# Altium project Breathalyzer.PrjPCB (part 1 of 2)
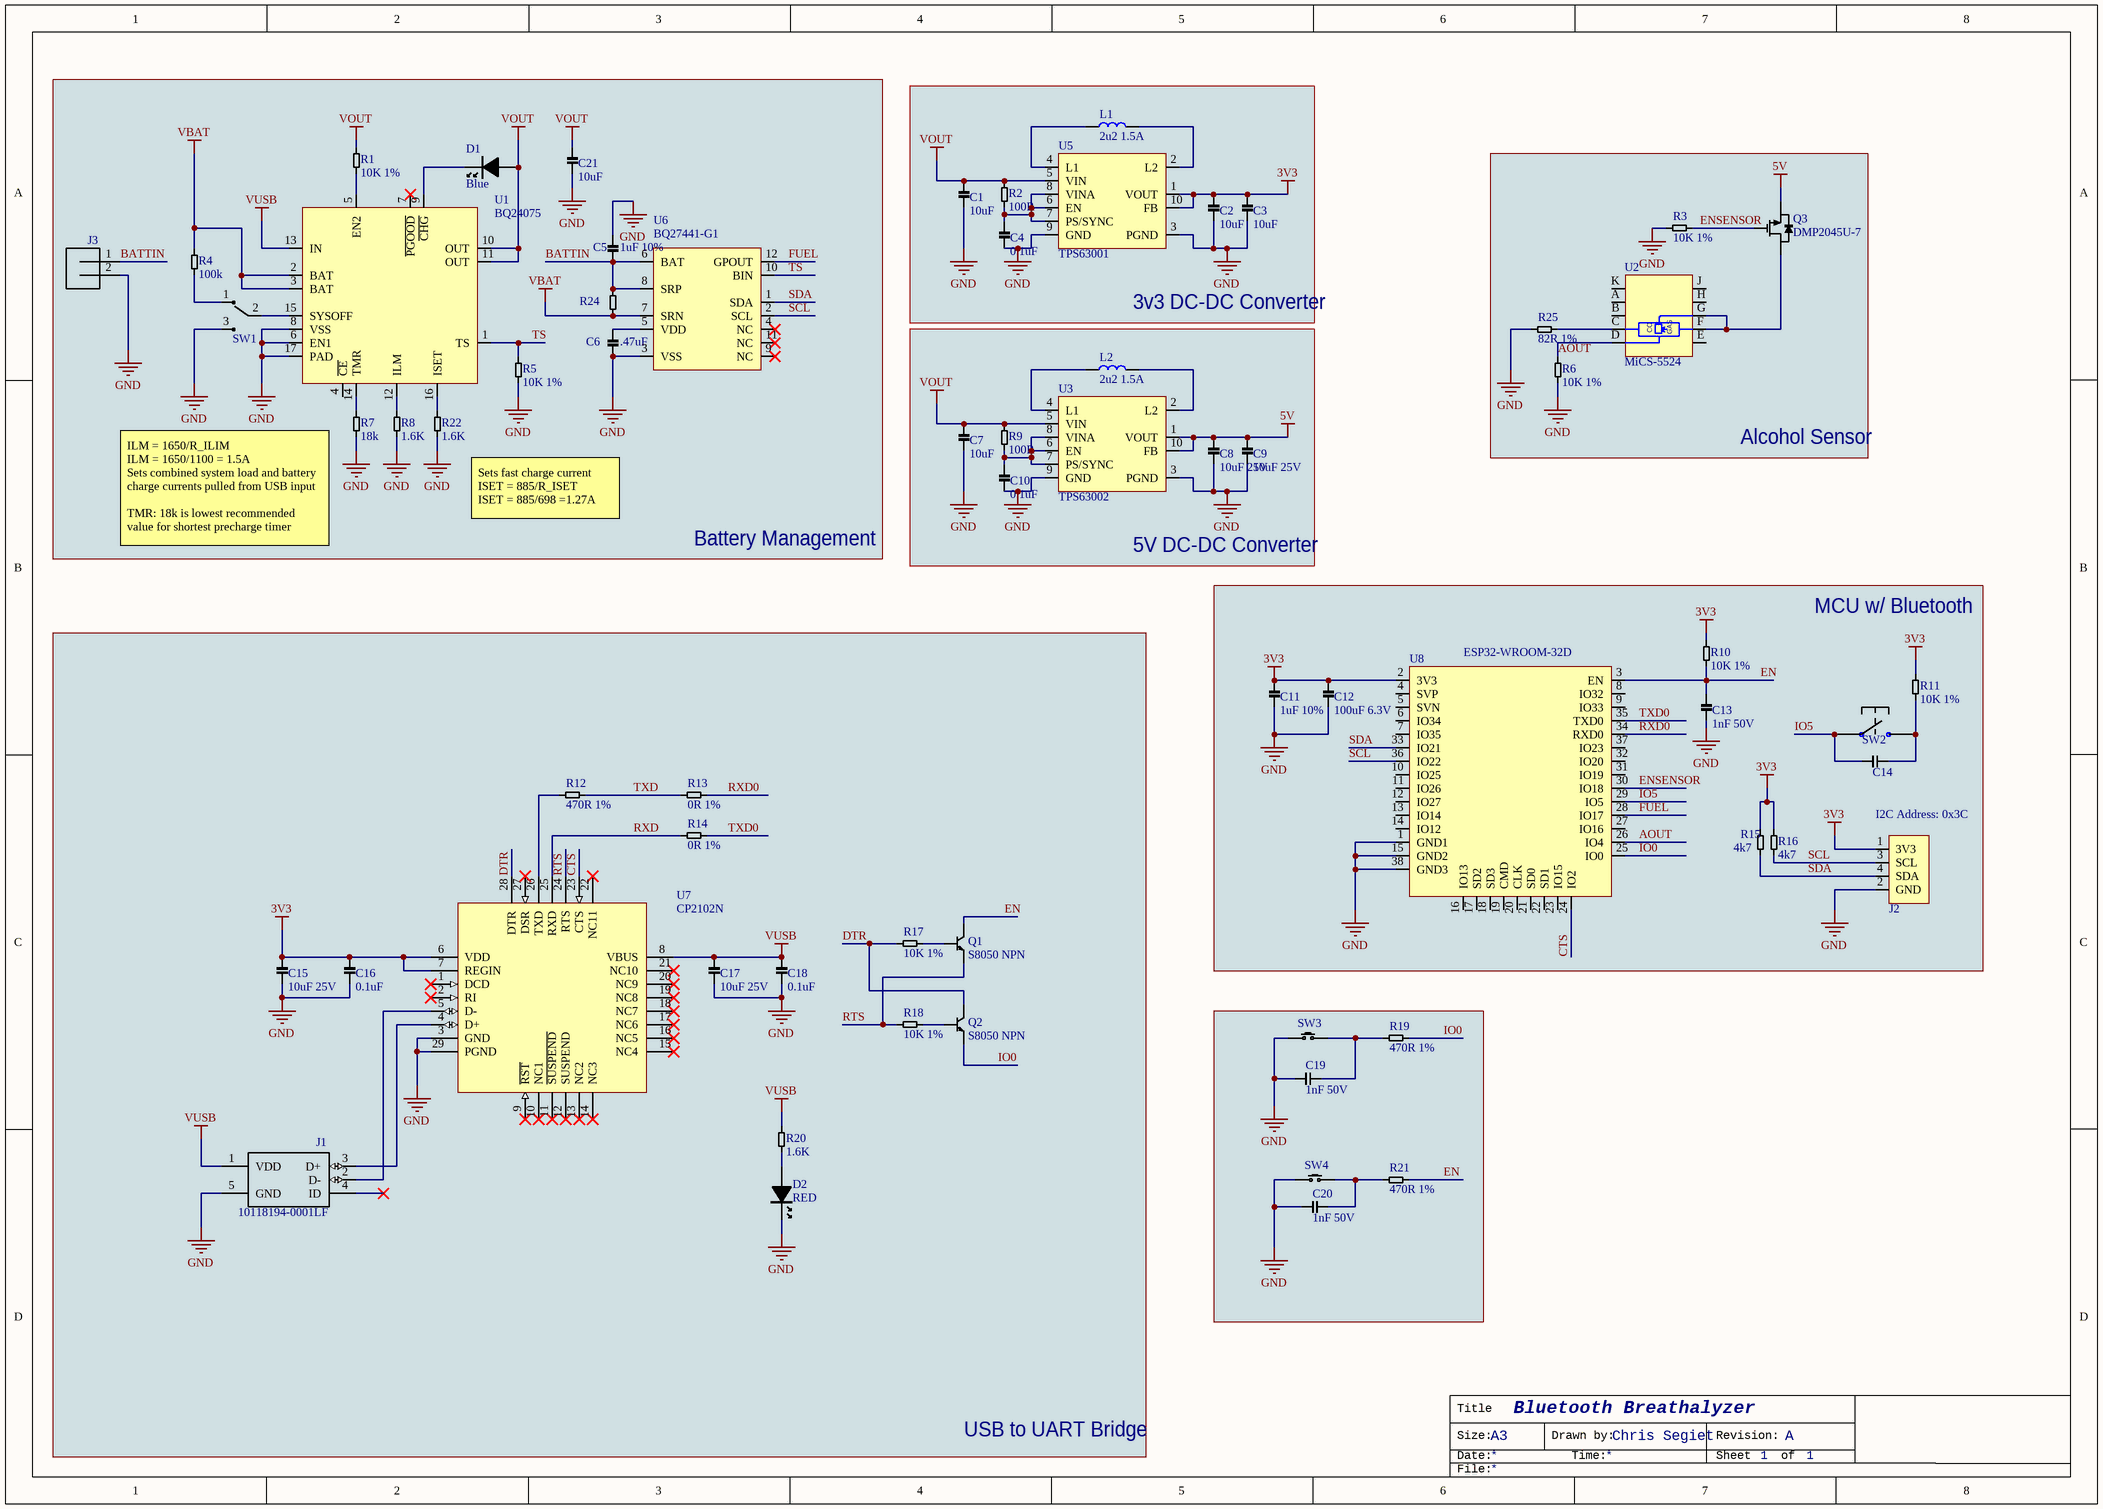
[diagram p0: Breathalyzer.SchDoc]
1 sheet, 66 parts. Net scope: global (net labels, ports and power ports of the same name join across sheets).
Board file: Breathalyzer.PcbDoc

## Sheet Breathalyzer.SchDoc: Bluetooth Breathalyzer
size A3; DrawnBy: Chris Segiet; Organization: Chris Segiet; Address1: New Lenox, IL 60451; Revision: A; SheetNumber: 1; SheetTotal: 1

### Parts
C1  10uF  [0805MLCC]
C2  10uF  [0805MLCC]
C3  10uF  [0805MLCC]
C4  0.1uF  [0603MLCC]
C5  1uF 10%  [0603MLCC]
C6  .47uF  [0805MLCC]
C7  10uF  [0805MLCC]
C8  10uF 25V  [1206MLCC]
C9  10uF 25V  [1206MLCC]
C10  0.1uF  [0603MLCC]
C11  1uF 10%  [0603MLCC]
C12  100uF 6.3V  [1206MLCC]
C13  1nF 50V  [0603MLCC]
C14  1nF 50V  [0603MLCC]  (value not drawn)
C15  10uF 25V  [1206MLCC]
C16  0.1uF  [0603MLCC]
C17  10uF 25V  [1206MLCC]
C18  0.1uF  [0603MLCC]
C19  1nF 50V  [0603MLCC]
C20  1nF 50V  [0603MLCC]
C21  10uF  [0805MLCC]
D1  Blue  [LTST-C193TBKT-5A]
D2  RED  [LEDC2012X75N_APT2012SRCPRV(Primary)]
J1  10118194-0001LF  [FRAMATOME_10118194-0001LF]
J2  Header for I2C Testing  [1x4 Header 2.54mm pitch]  (value not drawn)
J3  S2B-PH-SM4-TB  [JST_S2B-PH-SM4-TB]  (value not drawn)
L1  2u2 1.5A  [VLF4012AT-2R2M1R5]
L2  2u2 1.5A  [VLF4012AT-2R2M1R5]
Q1  S8050 NPN  [SOT23-NPN]
Q2  S8050 NPN  [SOT23-NPN]
Q3  DMP2045U-7  [SOT91P240X110-3N]
R1  10K 1%  [0805RES]
R2  100R  [0805RES]
R3  10K 1%  [0805RES]
R4  100k  [0603RES]
R5  10K 1%  [0805RES]
R6  10K 1%  [0805RES]
R7  18k  [0805RES]
R8  1.6K  [0805RES]
R9  100R  [0805RES]
R10  10K 1%  [0805RES]
R11  10K 1%  [0805RES]
R12  470R 1%  [0805RES]
R13  0R 1%  [0603RES]
R14  0R 1%  [0603RES]
R15  4k7  [0805RES]
R16  4k7  [0805RES]
R17  10K 1%  [0805RES]
R18  10K 1%  [0805RES]
R19  470R 1%  [0805RES]
R20  1.6K  [0805RES]
R21  470R 1%  [0805RES]
R22  1.6K  [0805RES]
R24  0.01R 1% 1W  [1206RES]  (value not drawn)
R25  82R 1%  [0805RES]
SW1  PCM12SMTR  [SW_PCM12SMTR_PCM12SMTR(Primary)]  (value not drawn)
SW2  PTS645SM43SMTR  [PTS645SM43SMTR]  (value not drawn)
SW3  SMD Light Touch Switch  [Tactile Switch]  (value not drawn)
SW4  SMD Light Touch Switch  [Tactile Switch]  (value not drawn)
U1  BQ24075  [VQFN 16-pin 0.5mm pitch]
U2  MiCS-5524  [MiCS5524 Ethanol Sensor]
U3  TPS63002  [SON50P300X300X100-11N]
U5  TPS63001  [SON50P300X300X100-11N]
U6  BQ27441-G1  [SON40P400X250X100-13N]
U7  CP2102N  [QFN50P500X500X80-29N]
U8  ESP32-WROOM-32D  [MODULE_ESP32-WROOM-32D]

### Blocks framed on the sheet
Battery Management: C5 C6 C21 D1 J3 R1 R4 R5 R7 R8 R22 R24 SW1 U1 U6
3v3 DC-DC Converter: C1-C4 L1 R2 U5
Alcohol Sensor: Q3 R3 R6 R25 U2
5V DC-DC Converter: C7-C10 L2 R9 U3
MCU w/ Bluetooth: C11-C14 J2 R10 R11 R15 R16 SW2 U8
USB to UART Bridge: C15-C18 D2 J1 Q1 Q2 R12-R14 R17 R18 R20 U7

### Nets
3V3: C2.2 C3.2 C11.2 C12.2 C15.2 C16.2 J2.1(3V3) R10.2 R11.2 R15.1 R16.2 U5.1(VOUT) U5.10(FB) U7.6(VDD) U7.7(REGIN) U8.2(3V3)
5V: C8.2 C9.2 Q3.S U3.1(VOUT) U3.10(FB)
GND: C1.2 C2.1 C3.1 C4.1 C5.2 C6.1 C7.2 C8.1 C9.1 C10.1 C11.1 C12.1 C13.1 C15.1 C16.1 C17.1 C18.1 C19.1 C20.1 C21.2 D2.2 J1.5(GND) J2.2(GND) J3.2 R3.2 R5.1 R6.1 R7.1 R8.1 R22.1 R25.1 SW1.3 SW3.1 SW4.1 U1.6(EN1) U1.8(VSS) U1.17(PAD) U3.3(PGND) U3.9(GND) U5.3(PGND) U5.9(GND) U6.3(VSS) U7.3(GND) U7.29(PGND) U8.1(GND1) U8.15(GND2) U8.38(GND3)
VBAT: R4.2 R24.1 U1.2(BAT) U1.3(BAT) U6.7(SRN)
VOUT: C1.1 C7.1 C21.1 D1.1 R1.2 R2.2 R9.2 U1.10(OUT) U1.11(OUT) U3.5(VIN) U5.5(VIN)
VUSB: C17.2 C18.2 J1.1(VDD) R20.2 U1.13(IN) U7.8(VBUS)
AOUT: R6.2 U2.D U8.26(IO4)
BATTIN: C5.1 J3.1 R24.2 U6.6(BAT) U6.8(SRP)
CTS: U7.23(CTS) U8.24(IO2)
DTR: Q2.C R17.1 U7.28(DTR)
EN: C13.2 Q1.C R10.1 R21.2 U8.3(EN)
ENSENSOR: Q3.G R3.1 U8.30(IO18)
FUEL: U6.12(GPOUT) U8.28(IO17)
IO0: Q2.E R19.2 U8.25(IO0)
IO5: C14.2 SW2.1(P$1) SW2.2(P$1) U8.29(IO5)
RTS: Q1.E R18.1 U7.24(RTS)
RXD: R14.1 U7.25(RXD)
RXD0: R13.2 U8.34(RXD0)
SCL: J2.3(SCL) R16.1 U6.2(SCL) U8.36(IO22)
SDA: J2.4(SDA) R15.2 U6.1(SDA) U8.33(IO21)
TS: R5.2 U1.1(TS) U6.10(BIN)
TXD: R12.2 R13.1
TXD0: R14.2 U8.35(TXD0)
NetC4_2: C4.2 R2.1 U5.6(EN) U5.7(PS/SYNC) U5.8(VINA)
NetC6_2: C6.2 U6.5(VDD)
NetC10_2: C10.2 R9.1 U3.6(EN) U3.7(PS/SYNC) U3.8(VINA)
NetC14_1: C14.1 R11.1 SW2.3(P$2) SW2.4(P$2)
NetC19_2: C19.2 R19.1 SW3.2
NetC20_2: C20.2 R21.1 SW4.2
NetD1_2: D1.2 U1.9(~{CHG})
NetD2_1: D2.1 R20.1
NetJ1_2: J1.2(D-) U7.5(D-)
NetJ1_3: J1.3(D+) U7.4(D+)
NetL1_1: L1.1 U5.4(L1)
NetL1_2: L1.2 U5.2(L2)
NetL2_1: L2.1 U3.4(L1)
NetL2_2: L2.2 U3.2(L2)
NetQ1_B: Q1.B R17.2
NetQ2_B: Q2.B R18.2
NetQ3_D: Q3.D U2.F U2.G
NetR1_1: R1.1 U1.5(EN2)
NetR4_1: R4.1 SW1.1
NetR7_2: R7.2 U1.14(TMR)
NetR8_2: R8.2 U1.12(ILM)
NetR12_1: R12.1 U7.26(TXD)
NetR22_2: R22.2 U1.16(ISET)
NetR25_2: R25.2 U2.C
NetSW1_2: SW1.2 U1.15(SYSOFF)

Not connected (* = marked no-connect by the designer): J1 4(ID)*; U1 4(~{CE}) 7(~{PGOOD})*; U2 A B E H J K; U6 4(NC)* 9(NC)* 11(NC)*; U7 1(DCD)* 2(RI)* 9(~{RST})* 10(NC1)* 11(~{SUSPEND})* 12(SUSPEND)* 13(NC2)* 14(NC3)* 15(NC4)* 16(NC5)* 17(NC6)* 18(NC7)* 19(NC8)* 20(NC9)* 21(NC10)* 22(NC11)* 27(DSR)*; U8 4(SVP) 5(SVN) 6(IO34) 7(IO35) 8(IO32) 9(IO33) 10(IO25) 11(IO26) 12(IO27) 13(IO14) 14(IO12) 16(IO13) 17(SD2) 18(SD3) 19(CMD) 20(CLK) 21(SD0) 22(SD1) 23(IO15) 27(IO16) 31(IO19) 32(IO20) 37(IO23)

### Notes on the sheet
- (near R22) Sets fast charge current
  ISET = 885/R_ISET
  ISET = 885/698 =1.27A
- (near R7) ILM = 1650/R_ILIM
  ILM = 1650/1100 = 1.5A
  Sets combined system load and battery charge currents pulled from USB input
  TMR: 18k is lowest recommended value for shortest precharge timer
- (near J2) I2C Address: 0x3C
- Title
- Size:
- Date:
- A3
- Drawn by:
- Time:
- Revision:
- Sheet
- of
- File:
- (in symbol MiCS-5524) CO; GAS